# EAGLE design ArduinoDevBoardRevA (EAGLE 9.0.0)

## Sheet 1 of 2
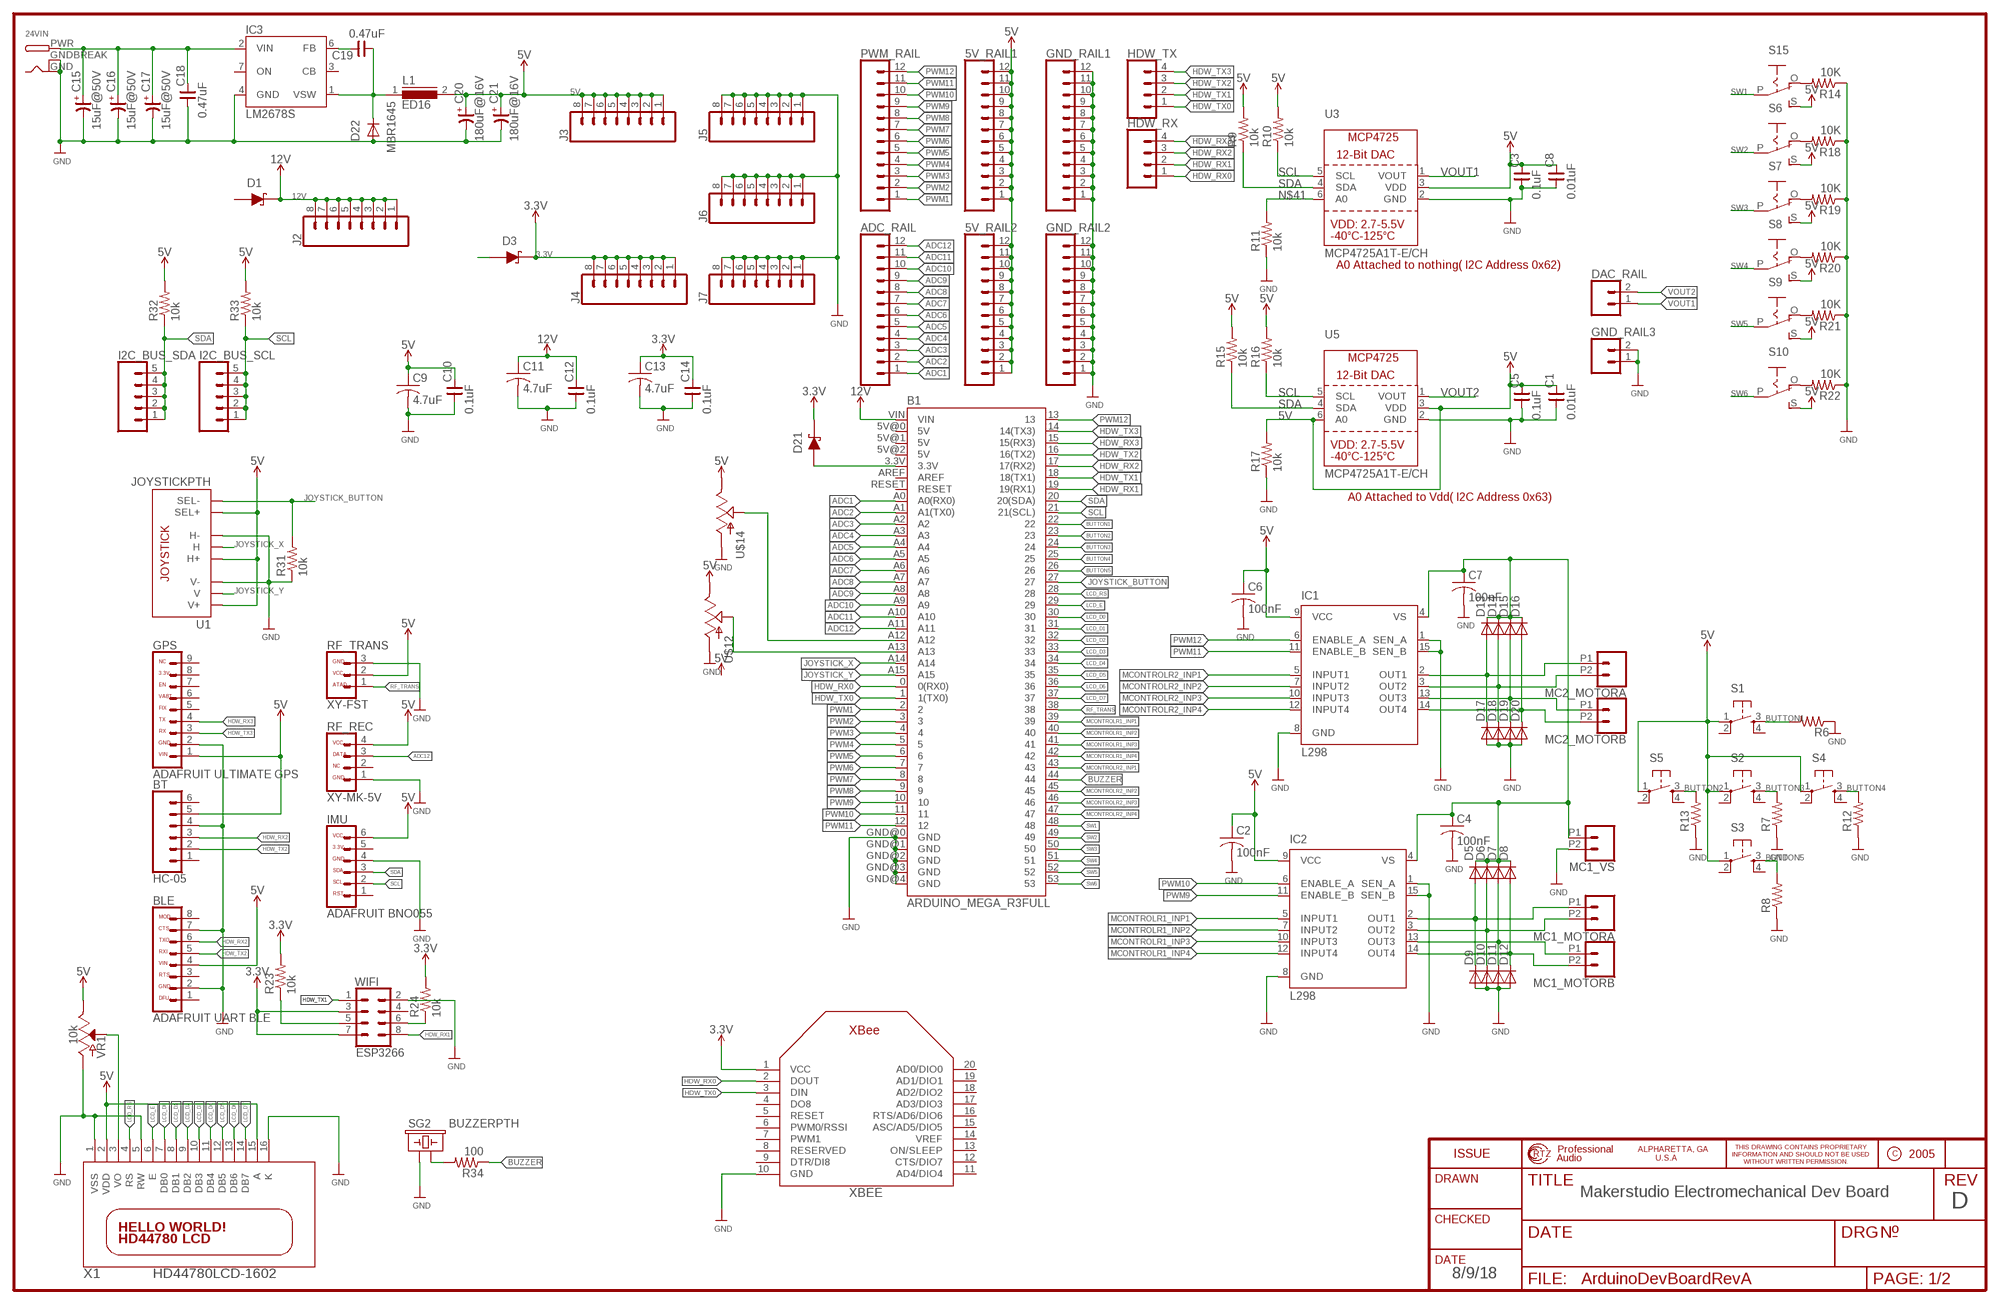
[diagram p0: schematic, sheet 1]

### Parts
5V_RAIL1  CONN_12  [1X12]
5V_RAIL2  CONN_12  [1X12]
24VIN  DCBARRELPTH  [DCJACK_2MM_PTH]
ADC_RAIL  CONN_12  [1X12]
B1  ARDUINO_MEGA_R3FULL  [ARDUINO_MEGA]
BLE  ADAFRUIT UART BLE  CONN_08"  [1X08]
BT  HC-05  CONN_06SILK_FEMALE_PTH  [1X06]
C1  0.01uF  CNP-0805  [0805]
C2  100nF  C-US050-024X044  [C050-024X044]
C3  0.1uF  CNP-0805  [0805]
C4  100nF  C-US050-024X044  [C050-024X044]
C5  0.1uF  CNP-0805  [0805]
C6  100nF  C-US050-024X044  [C050-024X044]
C7  100nF  C-US050-024X044  [C050-024X044]
C8  0.01uF  CNP-0805  [0805]
C9  4.7uF  C-US050-024X044  [C050-024X044]
C10  0.1uF  CNP-0805  [0805]
C11  4.7uF  C-USC0805  [C0805]
C12  0.1uF  CNP-0805  [0805]
C13  4.7uF  C-USC0805  [C0805]
C14  0.1uF  CNP-0805  [0805]
C15  15uF@50V  CP-E-025X065  [E-025X065]
C16  15uF@50V  CP-E-025X065  [E-025X065]
C17  15uF@50V  CP-E-025X065  [E-025X065]
C18  0.47uF  CNP-0805  [0805]
C19  0.47uF  CNP-0805  [0805]
C20  180uF@16V  CP-E-025X065  [E-025X065]
C21  180uF@16V  CP-E-025X065  [E-025X065]
D1  D_SCHOTTKYK  [SOD-123]
D3  D_SCHOTTKYK  [SOD-123]
D5  DIODE-D-5  [D-5]
D6  DIODE-D-5  [D-5]
D7  DIODE-D-5  [D-5]
D8  DIODE-D-5  [D-5]
D9  DIODE-D-5  [D-5]
D10  DIODE-D-5  [D-5]
D11  DIODE-D-5  [D-5]
D12  DIODE-D-5  [D-5]
D13  DIODE-D-5  [D-5]
D14  DIODE-D-5  [D-5]
D15  DIODE-D-5  [D-5]
D16  DIODE-D-5  [D-5]
D17  DIODE-D-5  [D-5]
D18  DIODE-D-5  [D-5]
D19  DIODE-D-5  [D-5]
D20  DIODE-D-5  [D-5]
D21  D_SCHOTTKYK  [SOD-123]
D22  MBR1645  MBR750  [TO220AC]
DAC_RAIL  CONN_02  [1X02]
GND_RAIL1  CONN_12  [1X12]
GND_RAIL2  CONN_12  [1X12]
GND_RAIL3  CONN_02  [1X02]
GPS  ADAFRUIT ULTIMATE GPS  CONN_09  [1X09]
HDW_RX  CONN_04  [1X04]
HDW_TX  CONN_04  [1X04]
I2C_BUS_SCL  CONN_05  [1X05]
I2C_BUS_SDA  CONN_05  [1X05]
IC1  L298  [MULTIWATT-15]
IC2  L298  [MULTIWATT-15]
IC3  LM2678S  [TO263-7]
IMU  ADAFRUIT BNO055  CONN_06SILK_FEMALE_PTH  [1X06]
J2  CONN_08"  [1X08]
J3  CONN_08"  [1X08]
J4  CONN_08"  [1X08]
J5  CONN_08"  [1X08]
J6  CONN_08"  [1X08]
J7  CONN_08"  [1X08]
L1  ED16  [ED16]
MC1_MOTORA  CONN_022.54MM_SCREWTERM  [1X02_2.54_SCREWTERM]
MC1_MOTORB  CONN_022.54MM_SCREWTERM  [1X02_2.54_SCREWTERM]
MC1_VS  CONN_022.54MM_SCREWTERM  [1X02_2.54_SCREWTERM]
MC2_MOTORA  CONN_022.54MM_SCREWTERM  [1X02_2.54_SCREWTERM]
MC2_MOTORB  CONN_022.54MM_SCREWTERM  [1X02_2.54_SCREWTERM]
PWM_RAIL  CONN_12  [1X12]
R6  R-US_R0805  [R0805]
R7  R-US_R0805  [R0805]
R8  R-US_R0805  [R0805]
R9  10k  R-US_R0805  [R0805]
R10  10k  R-US_R0805  [R0805]
R11  10k  R-US_R0805  [R0805]
R12  R-US_R0805  [R0805]
R13  R-US_R0805  [R0805]
R14  10K  R-US_R0805  [R0805]
R15  10k  R-US_R0805  [R0805]
R16  10k  R-US_R0805  [R0805]
R17  10k  R-US_R0805  [R0805]
R18  10K  R-US_R0805  [R0805]
R19  10K  R-US_R0805  [R0805]
R20  10K  R-US_R0805  [R0805]
R21  10K  R-US_R0805  [R0805]
R22  10K  R-US_R0805  [R0805]
R23  10k  R-US_R0805  [R0805]
R24  10k  R-US_R0805  [R0805]
R31  10k  R-US_R0805  [R0805]
R32  10k  R-US_R0805  [R0805]
R33  10k  R-US_R0805  [R0805]
R34  100  R-US_R0805  [R0805]
RF_REC  XY-MK-5V  CONN_04  [1X04]
RF_TRANS  XY-FST  CONN_03  [1X03]
S1  TAC_SWITCHSMD  [TACTILE_SWITCH_SMD]
S2  TAC_SWITCHSMD  [TACTILE_SWITCH_SMD]
S3  TAC_SWITCHSMD  [TACTILE_SWITCH_SMD]
S4  TAC_SWITCHSMD  [TACTILE_SWITCH_SMD]
S5  TAC_SWITCHSMD  [TACTILE_SWITCH_SMD]
S6  EG1218S  [EG1218]
S7  EG1218S  [EG1218]
S8  EG1218S  [EG1218]
S9  EG1218S  [EG1218]
S10  EG1218S  [EG1218]
S15  EG1218S  [EG1218]
SG2  BUZZERPTH  [BUZZER-12MM]
U1  JOYSTICKPTH  [JOYSTICK]
U3  MCP4725A1T-E/CH  DAC_MCP4725  [SOT23-6]
U5  MCP4725A1T-E/CH  DAC_MCP4725  [SOT23-6]
U$12  POT  [ALPS_POT]
U$14  POT  [ALPS_POT]
VR1  10k  POTENTIOMETER-PTH-9MM-1/20W-20%-KIT  [POT-PTH-ALPS-KIT]
WIFI  ESP3266  CONN_04X2  [2X4]
X1  HD44780LCD-1602  [LCD1602]
XBEE  XBEE  [XBEE]

### Nets
3.3V [3.3V]: C13.1 C14.2 D3.2(C) D21.2(C) J4.1 J4.2 J4.3 J4.4 J4.5 J4.6 J4.7 J4.8 R23.2 R24.2 WIFI.3 WIFI.7 XBEE.1(VCC)
5V [5V]: 5V_RAIL1.1 5V_RAIL1.2 5V_RAIL1.3 5V_RAIL1.4 5V_RAIL1.5 5V_RAIL1.6 5V_RAIL1.7 5V_RAIL1.8 5V_RAIL1.9 5V_RAIL1.10 5V_RAIL1.11 5V_RAIL1.12 5V_RAIL2.1 5V_RAIL2.2 5V_RAIL2.3 5V_RAIL2.4 5V_RAIL2.5 5V_RAIL2.6 5V_RAIL2.7 5V_RAIL2.8 5V_RAIL2.9 5V_RAIL2.10 5V_RAIL2.11 5V_RAIL2.12 BLE.4 BT.5 C1.2 C2.1 C3.2 C5.2 C6.1 C8.2 C9.1 C10.2 C20.+ C21.+ GPS.1 IC1.9(VCC) IC2.9(VCC) IMU.6 J3.1 J3.2 J3.3 J3.4 J3.5 J3.6 J3.7 J3.8 L1.2 R9.2 R10.2 R15.2 R16.2 R17.2 R32.2 R33.2 RF_REC.4 RF_TRANS.2 S1.1 S2.1 S3.1 S4.1 S5.1 S6.S S7.S S8.S S9.S S10.S S15.S U1.B1A(SEL+) U1.H1(H+) U1.V1(V+) U3.3(VDD) U5.3(VDD) U5.6(A0) U$12.P$1(E) U$14.P$1(E) VR1.P$1(E) X1.2(VDD) X1.15(A) ; also sheet 2
12V [12V]: B1.VIN C11.1 C12.2 D1.2(C) J2.1 J2.2 J2.3 J2.4 J2.5 J2.6 J2.7 J2.8
ADC1: ADC_RAIL.1 B1.A0(A0(RX0)) ; also sheet 2
ADC2: ADC_RAIL.2 B1.A1(A1(TX0)) ; also sheet 2
ADC3: ADC_RAIL.3 B1.A2 ; also sheet 2
ADC4: ADC_RAIL.4 B1.A3
ADC5: ADC_RAIL.5 B1.A4
ADC6: ADC_RAIL.6 B1.A5
ADC7: ADC_RAIL.7 B1.A6
ADC8: ADC_RAIL.8 B1.A7
ADC9: ADC_RAIL.9 B1.A8
ADC10: ADC_RAIL.10 B1.A9
ADC11: ADC_RAIL.11 B1.A10
ADC12: ADC_RAIL.12 B1.A11 RF_REC.3
BUTTON1: B1.22 R6.2 S1.3
BUTTON2: B1.23 R13.2 S5.3
BUTTON3: B1.24 R7.2 S2.3
BUTTON4: B1.25 R12.2 S4.3
BUTTON5: B1.26 R8.2 S3.3
BUZZER: B1.44 R34.1
GND: 24VIN.GND 24VIN.GNDBREAK B1.GND@0(GND) B1.GND@1(GND) B1.GND@2(GND) B1.GND@3(GND) B1.GND@4(GND) BLE.2 BLE.7 BT.4 C1.1 C2.2 C3.1 C4.2 C5.1 C6.2 C7.2 C8.1 C9.2 C10.1 C11.2 C12.1 C13.2 C14.1 C15.- C16.- C17.- C18.1 C20.- C21.- D9.A D10.A D11.A D12.A D17.A D18.A D19.A D20.A D22.A GND_RAIL1.1 GND_RAIL1.2 GND_RAIL1.3 GND_RAIL1.4 GND_RAIL1.5 GND_RAIL1.6 GND_RAIL1.7 GND_RAIL1.8 GND_RAIL1.9 GND_RAIL1.10 GND_RAIL1.11 GND_RAIL1.12 GND_RAIL2.1 GND_RAIL2.2 GND_RAIL2.3 GND_RAIL2.4 GND_RAIL2.5 GND_RAIL2.6 GND_RAIL2.7 GND_RAIL2.8 GND_RAIL2.9 GND_RAIL2.10 GND_RAIL2.11 GND_RAIL2.12 GND_RAIL3.1 GND_RAIL3.2 GPS.2 IC1.1(SEN_A) IC1.8(GND) IC1.15(SEN_B) IC2.1(SEN_A) IC2.8(GND) IC2.15(SEN_B) IC3.4(GND) IMU.4 J5.1 J5.2 J5.3 J5.4 J5.5 J5.6 J5.7 J5.8 J6.1 J6.2 J6.3 J6.4 J6.5 J6.6 J6.7 J6.8 J7.1 J7.2 J7.3 J7.4 J7.5 J7.6 J7.7 J7.8 MC1_VS.P2 R6.1 R7.1 R8.1 R11.1 R12.1 R13.1 R14.1 R17.1 R18.1 R19.1 R20.1 R21.1 R22.1 R31.1 RF_REC.1 RF_TRANS.3 SG2.+ U1.H3(H-) U1.V3(V-) U3.2(GND) U5.2(GND) U$12.P$3(A) U$14.P$3(A) VR1.P$3(A) WIFI.2 X1.1(VSS) X1.5(RW) X1.16(K) XBEE.10(GND) ; also sheet 2
HDW_RX0: B1.0(0(RX0)) HDW_RX.1 XBEE.2(DOUT)
HDW_RX1: B1.19(19(RX1)) HDW_RX.2 WIFI.8
HDW_RX2: B1.17(17(RX2)) BLE.6 BT.3 HDW_RX.3
HDW_RX3: B1.15(15(RX3)) GPS.4 HDW_RX.4
HDW_TX0: B1.1(1(TX0)) HDW_TX.1 XBEE.3(DIN)
HDW_TX1: B1.18(18(TX1)) HDW_TX.2 WIFI.1
HDW_TX2: B1.16(16(TX2)) BLE.5 BT.2 HDW_TX.3
HDW_TX3: B1.14(14(TX3)) GPS.3 HDW_TX.4
JOYSTICK_BUTTON: B1.27 R31.2 U1.B2A(SEL-)
JOYSTICK_X: B1.A14 U1.H2(H)
JOYSTICK_Y: B1.A15 U1.V2(V)
LCD_D0: B1.30 X1.7(DB0)
LCD_D1: B1.31 X1.8(DB1)
LCD_D2: B1.32 X1.9(DB2)
LCD_D3: B1.33 X1.10(DB3)
LCD_D4: B1.34 X1.11(DB4)
LCD_D5: B1.35 X1.12(DB5)
LCD_D6: B1.36 X1.13(DB6)
LCD_D7: B1.37 X1.14(DB7)
LCD_E: B1.29 X1.6(E)
LCD_RS: B1.28 X1.4(RS)
MCONTROLR1_INP1: B1.39 IC2.5(INPUT1)
MCONTROLR1_INP2: B1.40 IC2.7(INPUT2)
MCONTROLR1_INP3: B1.41 IC2.10(INPUT3)
MCONTROLR1_INP4: B1.42 IC2.12(INPUT4)
MCONTROLR2_INP1: B1.43 IC1.5(INPUT1)
MCONTROLR2_INP2: B1.45 IC1.7(INPUT2)
MCONTROLR2_INP3: B1.46 IC1.10(INPUT3)
MCONTROLR2_INP4: B1.47 IC1.12(INPUT4)
N$1 [3.3V]: B1.3.3V D21.1(A)
N$2: R23.1 WIFI.5
N$3: 24VIN.PWR C15.+ C16.+ C17.+ C18.2 IC3.2(VIN)
N$4: R24.1 WIFI.6
N$6: C19.1 D22.C IC3.1(VSW) L1.1
N$7: C19.2 IC3.6(FB)
N$11 [12V]: D3.1(A)
N$12 [12V]: C4.1 C7.1 D5.C D6.C D7.C D8.C D13.C D14.C D15.C D16.C IC1.4(VS) IC2.4(VS) MC1_VS.P1
N$33 [12V]: D13.A D17.C IC1.2(OUT1) MC2_MOTORA.P1
N$34 [12V]: D14.A D18.C IC1.3(OUT2) MC2_MOTORA.P2
N$35 [12V]: D15.A D19.C IC1.13(OUT3) MC2_MOTORB.P1
N$36 [12V]: D16.A D20.C IC1.14(OUT4) MC2_MOTORB.P2
N$37: B1.A12 U$14.P$2(S)
N$38: B1.A13 U$12.P$2(S)
N$39: VR1.P$2(S) X1.3(VO)
N$40: R34.2 SG2.-
N$41: R11.2 U3.6(A0)
N$46 [12V]: D5.A D9.C IC2.2(OUT1) MC1_MOTORA.P1
N$47 [12V]: D6.A D10.C IC2.3(OUT2) MC1_MOTORA.P2
N$48 [12V]: D7.A D11.C IC2.13(OUT3) MC1_MOTORB.P1
N$49 [12V]: D8.A D12.C IC2.14(OUT4) MC1_MOTORB.P2
N$50: R14.2 S15.O
N$52: R18.2 S6.O
N$53: R19.2 S7.O
N$54: R20.2 S8.O
N$55: R21.2 S9.O
N$56: R22.2 S10.O
PWM1: B1.2 PWM_RAIL.1
PWM2: B1.3 PWM_RAIL.2
PWM3: B1.4 PWM_RAIL.3
PWM4: B1.5 PWM_RAIL.4
PWM5: B1.6 PWM_RAIL.5
PWM6: B1.7 PWM_RAIL.6
PWM7: B1.8 PWM_RAIL.7
PWM8: B1.9 PWM_RAIL.8
PWM9: B1.10 IC2.11(ENABLE_B) PWM_RAIL.9
PWM10: B1.11 IC2.6(ENABLE_A) PWM_RAIL.10
PWM11: B1.12 IC1.11(ENABLE_B) PWM_RAIL.11
PWM12: B1.13 IC1.6(ENABLE_A) PWM_RAIL.12
RF_TRANS: B1.38 RF_TRANS.1
SCL: B1.21(21(SCL)) I2C_BUS_SCL.1 I2C_BUS_SCL.2 I2C_BUS_SCL.3 I2C_BUS_SCL.4 I2C_BUS_SCL.5 IMU.2 R10.1 R16.1 R33.1 U3.5(SCL) U5.5(SCL) ; also sheet 2
SDA: B1.20(20(SDA)) I2C_BUS_SDA.1 I2C_BUS_SDA.2 I2C_BUS_SDA.3 I2C_BUS_SDA.4 I2C_BUS_SDA.5 IMU.3 R9.1 R15.1 R32.1 U3.4(SDA) U5.4(SDA) ; also sheet 2
SW1: B1.48 S15.P
SW2: B1.49 S6.P
SW3: B1.50 S7.P
SW4: B1.51 S8.P
SW5: B1.52 S9.P
SW6: B1.53 S10.P
VOUT1: DAC_RAIL.1 U3.1(VOUT)
VOUT2: DAC_RAIL.2 U5.1(VOUT)
Unconnected: B1.5V@0(5V) B1.5V@1(5V) B1.5V@2(5V) B1.AREF B1.RESET BLE.1 BLE.3 BLE.8 BT.1 BT.6 D1.1(A) GPS.5 GPS.6 GPS.7 GPS.8 GPS.9 IC3.3(CB) IC3.7(ON) IMU.1 IMU.5 RF_REC.2 S1.2 S1.4 S2.2 S2.4 S3.2 S3.4 S4.2 S4.4 S5.2 S5.4 WIFI.4 XBEE.4(DO8) XBEE.5(RESET) XBEE.6(PWM0/RSSI) XBEE.7(PWM1) XBEE.8(RESERVED) XBEE.9(DTR/DI8) XBEE.11(AD4/DIO4) XBEE.12(CTS/DIO7) XBEE.13(ON/SLEEP) XBEE.14(VREF) XBEE.15(ASC/AD5/DIO5) XBEE.16(RTS/AD6/DIO6) XBEE.17(AD3/DIO3) XBEE.18(AD2/DIO2) XBEE.19(AD1/DIO1) XBEE.20(AD0/DIO0)

### Notes on the sheet
- A0 Attached to nothing( I2C Address 0x62)
- A0 Attached to Vdd( I2C Address 0x63)
- NC | GND
- 3.3V | VCC
- EN | ATAD
- VABT
- FIX
- TX
- RX
- GND | VCC
- VIN | DATA
- NC
- GND
- VCC
- 3.3V
- GND
- SDA
- SCL
- RST
- MOD
- CTS
- TXO
- RXI
- VIN
- RTS
- GND
- DFU
- Makerstudio Electromechanical Dev Board
- D
- 8/9/18

## Sheet 2 of 2
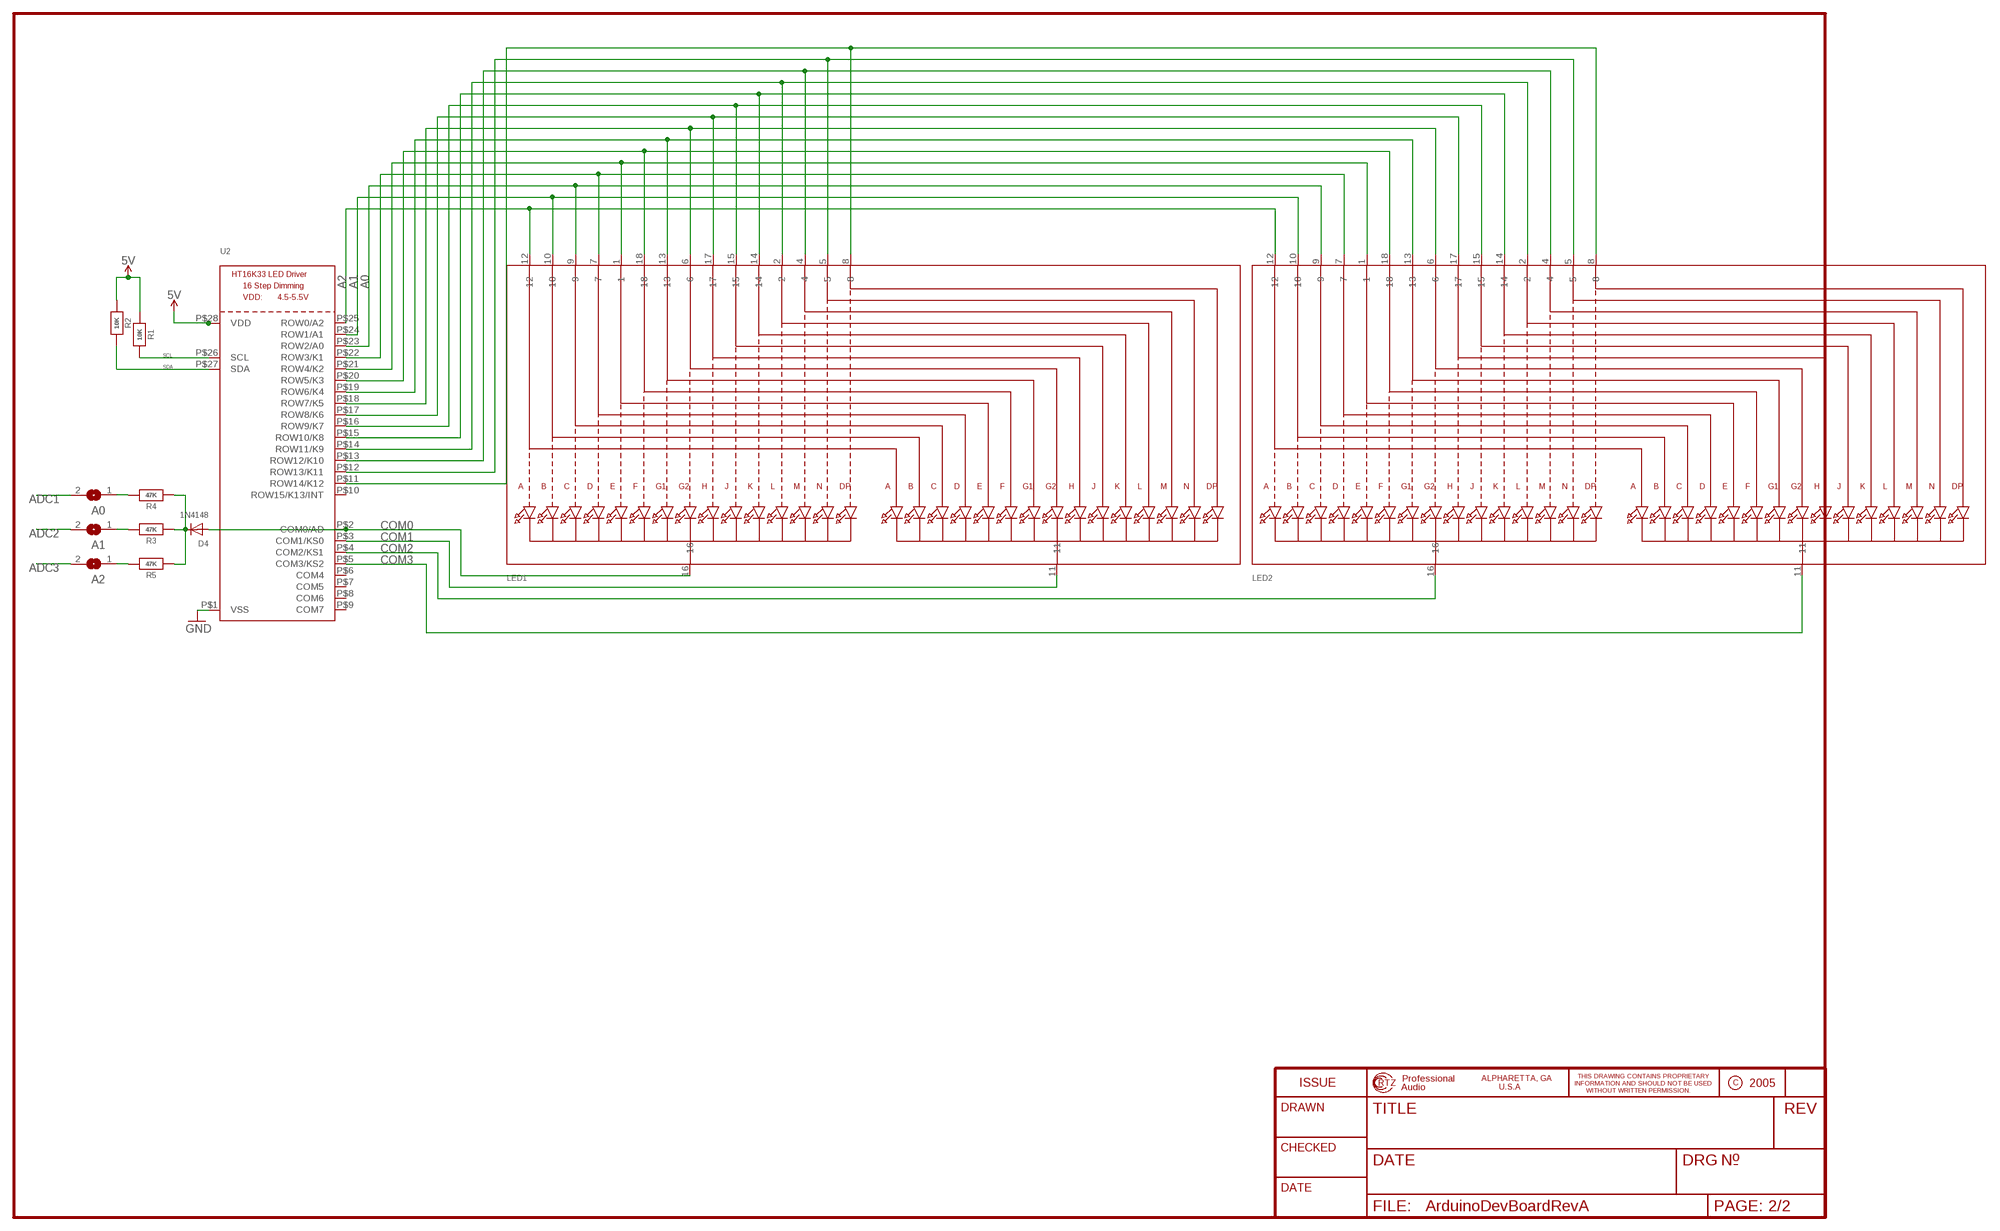
[diagram p1: schematic, sheet 2]

### Parts
A0  SOLDERJUMPERREFLOW_NOPASTE  [SOLDERJUMPER_REFLOW_NOPASTE]
A1  SOLDERJUMPERREFLOW_NOPASTE  [SOLDERJUMPER_REFLOW_NOPASTE]
A2  SOLDERJUMPERREFLOW_NOPASTE  [SOLDERJUMPER_REFLOW_NOPASTE]
D4  1N4148  DIODESOD-323F  [SOD-323F]
LED1  DISP_SEGMENT_STARBURST_DUAL_COMMONCATHODE  [SEGMENT_STARTBUST_DUAL_KWA-541CBB]
LED2  DISP_SEGMENT_STARBURST_DUAL_COMMONCATHODE  [SEGMENT_STARTBUST_DUAL_KWA-541CBB]
R1  10K  RESISTOR0805_NOOUTLINE  [0805-NO]
R2  10K  RESISTOR0805_NOOUTLINE  [0805-NO]
R3  47K  RESISTOR0805_NOOUTLINE  [0805-NO]
R4  47K  RESISTOR0805_NOOUTLINE  [0805-NO]
R5  47K  RESISTOR0805_NOOUTLINE  [0805-NO]
U2  HT16K33_SOP28  [SOP28_300MIL]

### Nets
5V [5V]: R1.1 R2.1 U2.P$28(VDD) ; also sheet 1
A0: LED1.9 LED2.9 U2.P$23(ROW2/A0)
A1: LED1.10 LED2.10 U2.P$24(ROW1/A1)
A2: LED1.12 LED2.12 U2.P$25(ROW0/A2)
ADC1: A0.2 ; also sheet 1
ADC2: A1.2 ; also sheet 1
ADC3: A2.2 ; also sheet 1
COM0: D4.A LED1.16 U2.P$2(COM0/AD)
COM1: LED1.11 U2.P$3(COM1/KS0)
COM2: LED2.16 U2.P$4(COM2/KS1)
COM3: LED2.11 U2.P$5(COM3/KS2)
GND: U2.P$1(VSS) ; also sheet 1
N$16: LED1.7 LED2.7 U2.P$22(ROW3/K1)
N$17: LED1.1 LED2.1 U2.P$21(ROW4/K2)
N$18: LED1.18 LED2.18 U2.P$20(ROW5/K3)
N$19: A1.1 R3.2
N$20: A0.1 R4.2
N$21: LED1.13 LED2.13 U2.P$19(ROW6/K4)
N$22: LED1.6 LED2.6 U2.P$18(ROW7/K5)
N$23: D4.C R3.1 R4.1 R5.1
N$24: A2.1 R5.2
N$25: LED1.17 LED2.17 U2.P$17(ROW8/K6)
N$26: LED1.15 LED2.15 U2.P$16(ROW9/K7)
N$27: LED1.14 LED2.14 U2.P$15(ROW10/K8)
N$28: LED1.2 LED2.2 U2.P$14(ROW11/K9)
N$29: LED1.4 LED2.4 U2.P$13(ROW12/K10)
N$30: LED1.5 LED2.5 U2.P$12(ROW13/K11)
N$31: LED1.8 LED2.8 U2.P$11(ROW14/K12)
SCL: R1.2 U2.P$26(SCL) ; also sheet 1
SDA: R2.2 U2.P$27(SDA) ; also sheet 1
Unconnected: U2.P$6(COM4) U2.P$7(COM5) U2.P$8(COM6) U2.P$9(COM7) U2.P$10(ROW15/K13/INT)

## Library data of the parts
5V_RAIL1 5V_RAIL2 ADC_RAIL GND_RAIL1 GND_RAIL2 PWM_RAIL = SparkFun-Connectors:CONN_12: Multi connection point. Often used as Generic Header-pin footprint for 0.1 inch spaced/style header connections On any of the 0.1 inch spaced packages, you can populate with these: Break Away Headers - Straight <https://www.sparkfun.com/products/116> (PRT-00116) Break Away Male Headers - Right Angle <https://www.sparkfun.com/products/553> (PRT-00553) Female Headers <https://www.sparkfun.com/products/115> (PRT-00115) Break Away Headers - Machine Pin <https://www.sparkfun.com/products/117> (PRT-00117) Break Away Female Headers - Swiss Machine Pin <https://www.sparkfun.com/products/743> (PRT-00743) For SCREWTERMINALS and SPRING TERMINALS visit here: Screw Terimnals on SparkFun.com <https://www.sparkfun.com/search/results?term=Screw+Terminals> (5mm/3.5mm/2.54mm spacing) This device is also useful as a general connection point to wire up your design to another part of your project. Our various solder wires solder well into these plated through hole pads. Hook-Up Wire - Assortment (Stranded, 22 AWG) <https://www.sparkfun.com/products/11375> (PRT-11375) Hook-Up Wire - Assortment (Solid Core, 22 AWG) <https://www.sparkfun.com/products/11367> (PRT-11367) View the entire wire category on our website here <https://www.sparkfun.com/categories/141> Special notes: Molex polarized connector foot print use with SKU : PRT-08231 with associated crimp pins and housings. 1MM SMD Version SKU: PRT-10208 NOTES ON THE VARIANTS LOCK and LOCK_LONGPADS... This footprint was designed to help hold the alignment of a through-hole component (i.e. 6-pin header) while soldering it into place. You may notice that each hole has been shifted either up or down by 0.005 of an inch from it's more standard position (which is a perfectly straight line). This slight alteration caused the pins (the squares in the middle) to touch the edges of the holes. Because they are alternating, it causes a "brace" to hold the component in place. 0.005 has proven to be the perfect amount of "off-center" position when using our standard breakaway headers. Although looks a little odd when you look at the bare footprint, once you have a header in there, the alteration is very hard to notice. Also,if you push a header all the way into place, it is covered up entirely on the bottom side.
24VIN = adafruit:DCBARREL: 2.0mm DC Barrel Jack DCJACK_2MM_PTH - Through Hole Jack (4UConnector: 05537)
A0 A1 A2 = microbuilder:SOLDERJUMPER: SMD Solder JUMPER Solder the two pads together to create a connection, or remove the solder to break it. REFLOW - Use this footprint for solder paste and reflow ovens. WAVE - Use this footprint for hand-soldering (larger pads). CLOSED - Has a trace between the two pads to ensure it is closed by default. The trace needs to be cut to disable the jumper, and can be closed again by creating a solder bridge between the two pads.
B1 = SparkFun-Boards:ARDUINO_MEGA_R3: Arduino Mega R3 ATmega2560 R3 compatible footprint. SparkFun Products: Arduino Mega 2560 R3 <https://www.sparkfun.com/products/11061>
BLE J2-J7 = SparkFun-Connectors:CONN_08: Multi connection point. Often used as Generic Header-pin footprint for 0.1 inch spaced/style header connections On any of the 0.1 inch spaced packages, you can populate with these: Break Away Headers - Straight <https://www.sparkfun.com/products/116> (PRT-00116) Break Away Male Headers - Right Angle <https://www.sparkfun.com/products/553> (PRT-00553) Female Headers <https://www.sparkfun.com/products/115> (PRT-00115) Break Away Headers - Machine Pin <https://www.sparkfun.com/products/117> (PRT-00117) Break Away Female Headers - Swiss Machine Pin <https://www.sparkfun.com/products/743> (PRT-00743) Arduino Stackable Header - 8 Pin <https://www.sparkfun.com/products/9279> (PRT-09279) For SCREWTERMINALS and SPRING TERMINALS visit here: Screw Terimnals on SparkFun.com <https://www.sparkfun.com/search/results?term=Screw+Terminals> (5mm/3.5mm/2.54mm spacing) This device is also useful as a general connection point to wire up your design to another part of your project. Our various solder wires solder well into these plated through hole pads. Hook-Up Wire - Assortment (Stranded, 22 AWG) <https://www.sparkfun.com/products/11375> (PRT-11375) Hook-Up Wire - Assortment (Solid Core, 22 AWG) <https://www.sparkfun.com/products/11367> (PRT-11367) View the entire wire category on our website here <https://www.sparkfun.com/categories/141> Special notes: Molex polarized connector foot print use with SKU : PRT-08231 with associated crimp pins and housings. 1MM SMD Version SKU: PRT-10208 NOTES ON THE VARIANTS LOCK and LOCK_LONGPADS... This footprint was designed to help hold the alignment of a through-hole component (i.e. 6-pin header) while soldering it into place. You may notice that each hole has been shifted either up or down by 0.005 of an inch from it's more standard position (which is a perfectly straight line). This slight alteration caused the pins (the squares in the middle) to touch the edges of the holes. Because they are alternating, it causes a "brace" to hold the component in place. 0.005 has proven to be the perfect amount of "off-center" position when using our standard breakaway headers. Although looks a little odd when you look at the bare footprint, once you have a header in there, the alteration is very hard to notice. Also,if you push a header all the way into place, it is covered up entirely on the bottom side.; PROD_ID: CONN-08438
BT IMU = SparkFun-Connectors:CONN_06: Multi connection point. Often used as Generic Header-pin footprint for 0.1 inch spaced/style header connections On any of the 0.1 inch spaced packages, you can populate with these: Break Away Headers - Straight <https://www.sparkfun.com/products/116> (PRT-00116) Break Away Male Headers - Right Angle <https://www.sparkfun.com/products/553> (PRT-00553) Female Headers <https://www.sparkfun.com/products/115> (PRT-00115) Break Away Headers - Machine Pin <https://www.sparkfun.com/products/117> (PRT-00117) Break Away Female Headers - Swiss Machine Pin <https://www.sparkfun.com/products/743> (PRT-00743) Arduino Stackable Header - 6 Pin <https://www.sparkfun.com/products/9280> (PRT-09280) For SCREWTERMINALS and SPRING TERMINALS visit here: Screw Terimnals on SparkFun.com <https://www.sparkfun.com/search/results?term=Screw+Terminals> (5mm/3.5mm/2.54mm spacing) This device is also useful as a general connection point to wire up your design to another part of your project. Our various solder wires solder well into these plated through hole pads. Hook-Up Wire - Assortment (Stranded, 22 AWG) <https://www.sparkfun.com/products/11375> (PRT-11375) Hook-Up Wire - Assortment (Solid Core, 22 AWG) <https://www.sparkfun.com/products/11367> (PRT-11367) View the entire wire category on our website here <https://www.sparkfun.com/categories/141>; PROD_ID: CONN-08437
C1 C3 C5 C8 C10 C12 C14 C18 C19 = cap-master:CNP-: NON-POLARIZED CAP
C2 C4 C6 C7 C9 C11 C13 = rcl:C-US: CAPACITOR, American symbol; SPICEPREFIX: C
C15-C17 C20 C21 = cap-master:CP-: POLARIZED CAP
D1 D3 D21 = MAX9812:D_SCHOTTKY: Schottky diodes in various packages
D4 = adafruit:DIODE: Diode SMADIODE - SMA Surface Mount Package 20V 1A Schottky Diode Digikey: 641-1014-6-ND DO-1N4148 - Through Hole Small Current Diode SOD-123 20V 1 A (.5mV Vf) Schottky Diode - Digikey: MBRX120TPMSCT-ND SOD-323 10V 570mA (.38mV Vf, 3ns) Schottky Diode - Digikey: ZLLS410CT-ND SOD-523 30V 30mA Schottky Diode (RB751S-40TE61) - Digikey: RB751S-40TE61CT-ND SOT23-R/W - SOT23 Package (R = Solder Paste/Reflow Ovens, W = Hand-Soldering) BAT54Film 40V 300mA - Digikey: 497-7162-1-ND
D5-D20 = diode:DIODE-: DIODE
D22 = diode:MBR750: DIODE barrier rectifier, 7.5 A, 50 V
DAC_RAIL GND_RAIL3 MC1_MOTORA MC1_MOTORB MC1_VS MC2_MOTORA MC2_MOTORB = SparkFun-Connectors:CONN_02: Multi connection point. Often used as Generic Header-pin footprint for 0.1 inch spaced/style header connections On any of the 0.1 inch spaced packages, you can populate with these: Break Away Headers - Straight <https://www.sparkfun.com/products/116> (PRT-00116) Break Away Male Headers - Right Angle <https://www.sparkfun.com/products/553> (PRT-00553) Female Headers <https://www.sparkfun.com/products/115> (PRT-00115) Break Away Headers - Machine Pin <https://www.sparkfun.com/products/117> (PRT-00117) Break Away Female Headers - Swiss Machine Pin <https://www.sparkfun.com/products/743> (PRT-00743) For SCREWTERMINALS and SPRING TERMINALS visit here: Screw Terimnals on SparkFun.com <https://www.sparkfun.com/search/results?term=Screw+Terminals> (5mm/3.5mm/2.54mm spacing) This device is also useful as a general connection point to wire up your design to another part of your project. Our various solder wires solder well into these plated through hole pads. Hook-Up Wire - Assortment (Stranded, 22 AWG) <https://www.sparkfun.com/products/11375> (PRT-11375) Hook-Up Wire - Assortment (Solid Core, 22 AWG) <https://www.sparkfun.com/products/11367> (PRT-11367) View the entire wire category on our website here <https://www.sparkfun.com/categories/141> Special notes: Molex polarized connector foot print use with: PRT-08233 with associated crimp pins and housings. 2.54_SCREWTERM for use with PRT-10571. 3.5mm Screw Terminal footprints for PRT-08084 5mm Screw Terminal footprints for use with PRT-08432
GPS = SparkFun-Connectors:CONN_09: Multi connection point. Often used as Generic Header-pin footprint for 0.1 inch spaced/style header connections On any of the 0.1 inch spaced packages, you can populate with these: Break Away Headers - Straight <https://www.sparkfun.com/products/116> (PRT-00116) Break Away Male Headers - Right Angle <https://www.sparkfun.com/products/553> (PRT-00553) Female Headers <https://www.sparkfun.com/products/115> (PRT-00115) Break Away Headers - Machine Pin <https://www.sparkfun.com/products/117> (PRT-00117) Break Away Female Headers - Swiss Machine Pin <https://www.sparkfun.com/products/743> (PRT-00743) For SCREWTERMINALS and SPRING TERMINALS visit here: Screw Terimnals on SparkFun.com <https://www.sparkfun.com/search/results?term=Screw+Terminals> (5mm/3.5mm/2.54mm spacing) This device is also useful as a general connection point to wire up your design to another part of your project. Our various solder wires solder well into these plated through hole pads. Hook-Up Wire - Assortment (Stranded, 22 AWG) <https://www.sparkfun.com/products/11375> (PRT-11375) Hook-Up Wire - Assortment (Solid Core, 22 AWG) <https://www.sparkfun.com/products/11367> (PRT-11367) View the entire wire category on our website here <https://www.sparkfun.com/categories/141> Special notes: Molex polarized connector foot print use with SKU : PRT-08231 with associated crimp pins and housings. 1MM SMD Version SKU: PRT-10208 NOTES ON THE VARIANTS LOCK and LOCK_LONGPADS... This footprint was designed to help hold the alignment of a through-hole component (i.e. 6-pin header) while soldering it into place. You may notice that each hole has been shifted either up or down by 0.005 of an inch from it's more standard position (which is a perfectly straight line). This slight alteration caused the pins (the squares in the middle) to touch the edges of the holes. Because they are alternating, it causes a "brace" to hold the component in place. 0.005 has proven to be the perfect amount of "off-center" position when using our standard breakaway headers. Although looks a little odd when you look at the bare footprint, once you have a header in there, the alteration is very hard to notice. Also,if you push a header all the way into place, it is covered up entirely on the bottom side.
HDW_RX HDW_TX RF_REC = SparkFun-Connectors:CONN_04: Multi connection point. Often used as Generic Header-pin footprint for 0.1 inch spaced/style header connections On any of the 0.1 inch spaced packages, you can populate with these: Break Away Headers - Straight <https://www.sparkfun.com/products/116> (PRT-00116) Break Away Male Headers - Right Angle <https://www.sparkfun.com/products/553> (PRT-00553) Female Headers <https://www.sparkfun.com/products/115> (PRT-00115) Break Away Headers - Machine Pin <https://www.sparkfun.com/products/117> (PRT-00117) Break Away Female Headers - Swiss Machine Pin <https://www.sparkfun.com/products/743> (PRT-00743) For SCREWTERMINALS and SPRING TERMINALS visit here: Screw Terimnals on SparkFun.com <https://www.sparkfun.com/search/results?term=Screw+Terminals> (5mm/3.5mm/2.54mm spacing) This device is also useful as a general connection point to wire up your design to another part of your project. Our various solder wires solder well into these plated through hole pads. Hook-Up Wire - Assortment (Stranded, 22 AWG) <https://www.sparkfun.com/products/11375> (PRT-11375) Hook-Up Wire - Assortment (Solid Core, 22 AWG) <https://www.sparkfun.com/products/11367> (PRT-11367) View the entire wire category on our website here <https://www.sparkfun.com/categories/141> Special notes: Molex polarized connector foot print use with SKU : PRT-08231 with associated crimp pins and housings. 1MM SMD Version SKU: PRT-10208; PROD_ID: CONN-09696
I2C_BUS_SCL I2C_BUS_SDA = SparkFun-Connectors:CONN_05: Multi connection point. Often used as Generic Header-pin footprint for 0.1 inch spaced/style header connections On any of the 0.1 inch spaced packages, you can populate with these: Break Away Headers - Straight <https://www.sparkfun.com/products/116> (PRT-00116) Break Away Male Headers - Right Angle <https://www.sparkfun.com/products/553> (PRT-00553) Female Headers <https://www.sparkfun.com/products/115> (PRT-00115) Break Away Headers - Machine Pin <https://www.sparkfun.com/products/117> (PRT-00117) Break Away Female Headers - Swiss Machine Pin <https://www.sparkfun.com/products/743> (PRT-00743) For SCREWTERMINALS and SPRING TERMINALS visit here: Screw Terimnals on SparkFun.com <https://www.sparkfun.com/search/results?term=Screw+Terminals> (5mm/3.5mm/2.54mm spacing) This device is also useful as a general connection point to wire up your design to another part of your project. Our various solder wires solder well into these plated through hole pads. Hook-Up Wire - Assortment (Stranded, 22 AWG) <https://www.sparkfun.com/products/11375> (PRT-11375) Hook-Up Wire - Assortment (Solid Core, 22 AWG) <https://www.sparkfun.com/products/11367> (PRT-11367) View the entire wire category on our website here <https://www.sparkfun.com/categories/141> Special notes: Molex polarized connector foot print use with SKU : PRT-08231 with associated crimp pins and housings. 1MM SMD Version SKU: PRT-10208
IC1 IC2 = st-microelectronics:L298: DUAL FULL-BRIDGE DRIVER; MPN: L298N; OC_FARNELL: 1589425; OC_NEWARK: 32M1527
IC3 = v-reg-3:LM2678: National Semiconductor <http://www.national.com> 5.0A "Simple Switcher"(c) 260kHz, Vout 1.2-37V, Vin 40V, 120mOhm DMOS switch, 50µA standby current
L1 = inductors:ED16: INDUCTOR; SPICEPREFIX: L
LED1 LED2 = microbuilder:DISP_SEGMENT_STARBURST_DUAL_COMMONCATHODE: 2 x Starburst Segment Displays - Common Cathode Luckylight KWA-541CBB
R1-R5 = microbuilder:RESISTOR: Resistors For new designs, use the packages preceded by an '_' character since they are more reliable: The following footprints should be used on most boards: _0402 - Standard footprint for regular board layouts _0603 - Standard footprint for regular board layouts _0805 - Standard footprint for regular board layouts _1206 - Standard footprint for regular board layouts For extremely tight-pitch boards where space is at a premium, the following 'micro-pitch' footprints can be used (smaller pads, no silkscreen outline, etc.): _0402MP - Micro-pitch footprint for very dense/compact boards _0603MP - Micro-pitch footprint for very dense/compact boards _0805MP - Micro-pitch footprint for very dense/compact boards _1206MP - Micro-pitch footprint for very dense/compact boards
R6-R24 R31-R34 = adafruit:R-US_: RESISTOR, American symbol
RF_TRANS = SparkFun-Connectors:CONN_03: Multi connection point. Often used as Generic Header-pin footprint for 0.1 inch spaced/style header connections On any of the 0.1 inch spaced packages, you can populate with these: Break Away Headers - Straight <https://www.sparkfun.com/products/116> (PRT-00116) Break Away Male Headers - Right Angle <https://www.sparkfun.com/products/553> (PRT-00553) Female Headers <https://www.sparkfun.com/products/115> (PRT-00115) Break Away Headers - Machine Pin <https://www.sparkfun.com/products/117> (PRT-00117) Break Away Female Headers - Swiss Machine Pin <https://www.sparkfun.com/products/743> (PRT-00743) Stackable Header - 3 Pin (Female, 0.1") <https://www.sparkfun.com/products/13875> (PRT-13875) For SCREWTERMINALS and SPRING TERMINALS visit here: Screw Terimnals on SparkFun.com <https://www.sparkfun.com/search/results?term=Screw+Terminals> (5mm/3.5mm/2.54mm spacing) This device is also useful as a general connection point to wire up your design to another part of your project. Our various solder wires solder well into these plated through hole pads. Hook-Up Wire - Assortment (Stranded, 22 AWG) <https://www.sparkfun.com/products/11375> (PRT-11375) Hook-Up Wire - Assortment (Solid Core, 22 AWG) <https://www.sparkfun.com/products/11367> (PRT-11367) View the entire wire category on our website here <https://www.sparkfun.com/categories/141> Special notes: Molex polarized connector foot print use with SKU : PRT-08232 with associated crimp pins and housings.
S1-S5 = SparkFun:TAC_SWITCH: Momentary Switch Button commonly used for reset or general input. Spark Fun Electronics SKU : COM-00097
S6-S10 S15 = adafruit:EG1218: SLIDING SWITCH 0.1" spacing through hole, vertical SPDT slide switch http://www.ladyada.net/library/pcb/eaglelibrary.html
SG2 = SparkFun:BUZZER: Buzzer 12mm Spark Fun Electronics SKU : Comp-Buzzer
U1 = adafruit:JOYSTICK: Thumb Joystick Joystick commonly found in PS2 controllers. Two pots and a select switch. Adapted from Sparkfun Library (but for more common 6mm switch sticks)
U2 = microbuilder:HT16K33_SOP28
U3 U5 = microbuilder:DAC_MCP4725: MCP4725 - 12-Bit I2C DAC with on-board EEPROM Settling Time: 6 µs 2.7-5.5V Supply 100kHz, 400kHz, 3.4 Mbps I²C EEPROM can be used to store a specific output voltage which will be set coming out of reset I²C Address: 1100 A2 A1 A0 A0 is set via the A0 pin, A2 and A1 are hard-wired on the chip depending on the model chosen: Part Number A2 A1 Code MCP4725A0T-E/CH 0 0 AJNN MCP4725A1T-E/CH 0 1 APNN MCP4725A2T-E/CH 1 0 AQNN MCP4725A3T-E/CH 1 1 ARNN
U$12 U$14 = SparkFun:POT
VR1 = SparkFun-Resistors:POTENTIOMETER: Potentiometer (Pot) Three-terminal potentiometers, with an adjustable wiper and two adjustable resistors. A pot can be used to create a configurable voltage divider, or as a variable resistor. Variants ALPS_POT and ALPS_POT_KIT - PTH, breadboard compatible, 9mm square pots Rotary Potentiometer - Linear (10k ohm) <https://www.sparkfun.com/products/9288> (COM-09288) The KIT variant exposes copper on only one side of the PTH pad, so the part can only be assembled on one side of the PCB. Useful for beginner soldering kits.; PROD_ID: RES-09177; SF_SKU: COM-09288
WIFI = SparkFun-Connectors:CONN_04X2: Multi connection point. Often used as Generic Header-pin footprint for 0.1 inch spaced/style header connections On any of the 0.1 inch spaced packages, you can populate with these: Break Away Headers - Straight <https://www.sparkfun.com/products/116> (PRT-00116) Break Away Male Headers - Right Angle <https://www.sparkfun.com/products/553> (PRT-00553) Female Headers <https://www.sparkfun.com/products/115> (PRT-00115) Break Away Headers - Machine Pin <https://www.sparkfun.com/products/117> (PRT-00117) Break Away Female Headers - Swiss Machine Pin <https://www.sparkfun.com/products/743> (PRT-00743)
X1 = adafruit:HD44780LCD: HD44780 LCD Standard character type LCDs, available in sizes from 8x1 to 40x4!
XBEE = adafruit:XBEE

## Net classes
0 default: width 0.203 mm, drill 0.254 mm, clearance 0.203 mm
1 5V: width 0.61 mm, drill 0.254 mm, clearance 0.203 mm
2 3.3V: width 0.61 mm, drill 0.254 mm, clearance 0.203 mm
3 12V: width 0.61 mm, drill 0.254 mm, clearance 0.203 mm
4 VIN: width 0.813 mm, drill 0.254 mm, clearance 0.203 mm

## Board
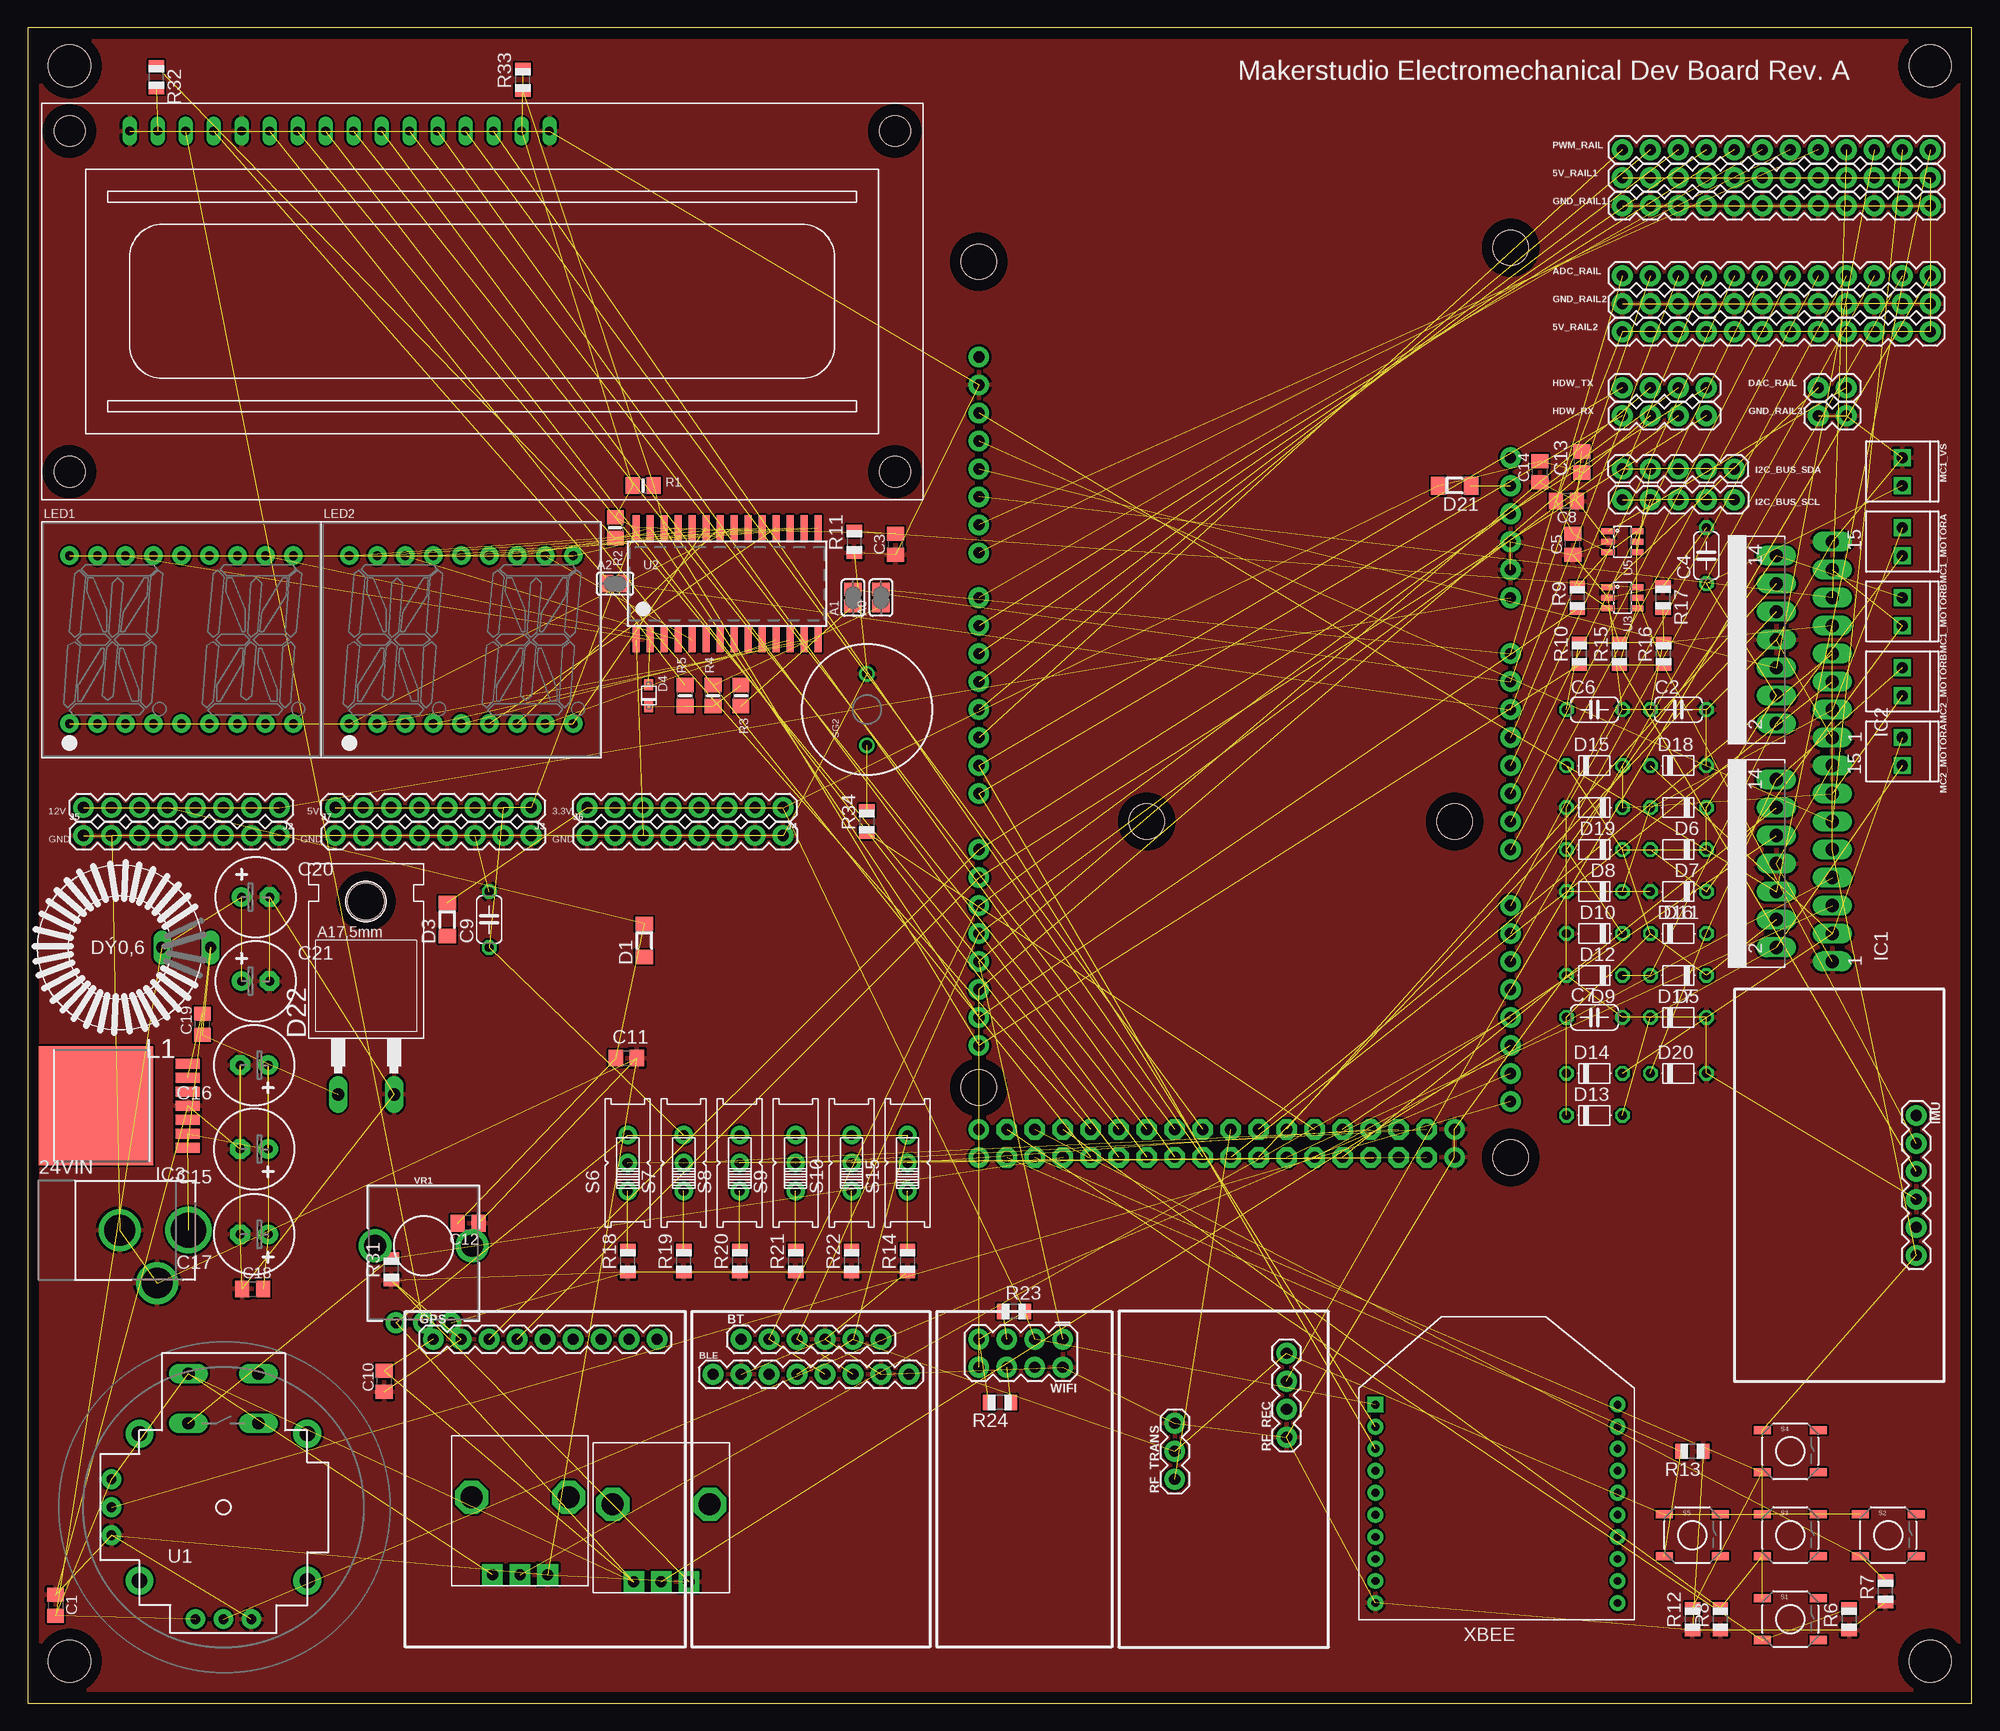
[diagram p2: board, top side]
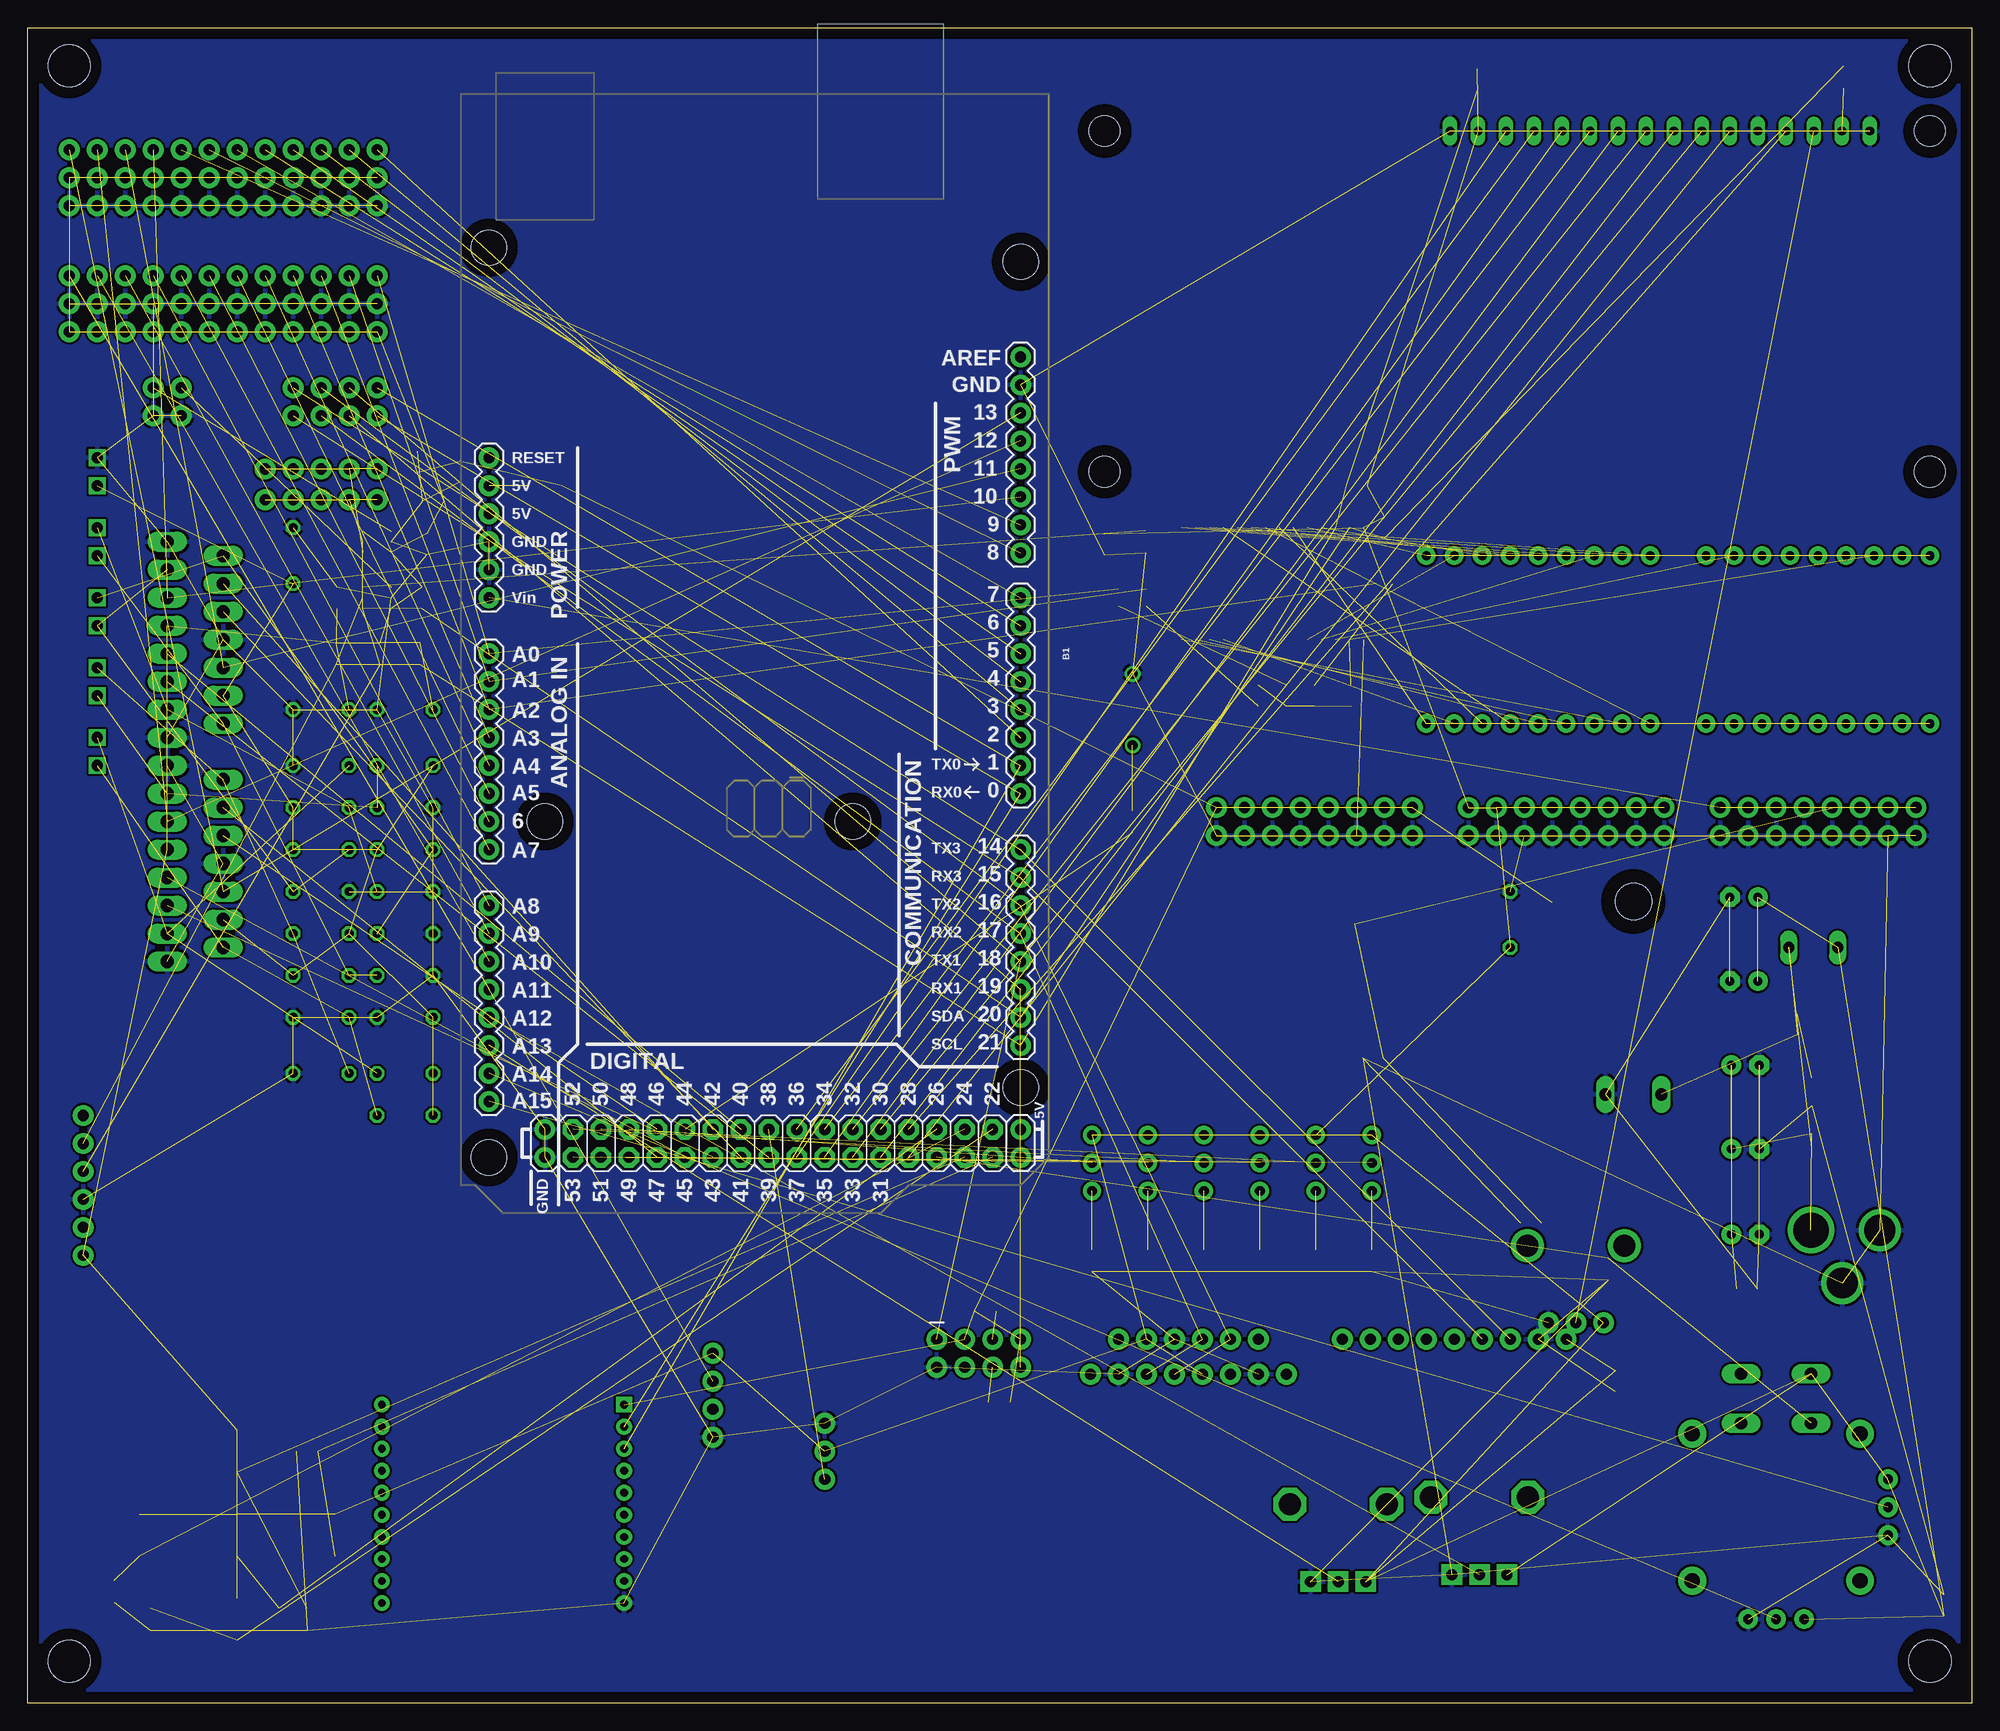
[diagram p3: board, bottom side, seen from below]

Size 176.51 x 152.07 mm. Coordinates in mm from the lower left corner, seen from the top.
Outline: 0,0 176.51,0 176.51,152.07 0,152.07 0,0
Copper layers (1*16): Top 0.035mm / dielectric 1.5mm / Bottom 0.035mm
Design rules "default *": minimum track width 6mil, minimum drill 0.2mm, track to track 8mil, track to pad 8mil, pad to pad 8mil, via to via 8mil, smd to smd 8mil, copper to edge 40mil, drill to drill 6mil, minimum pad ring 10mil, minimum via ring 8mil, stop-mask expansion 4mil, vias tented up to drill 0mil, thermal gap 10mil
Holes 3.81 mm at 3.81,148.59 172.72,148.59 172.72,3.81 3.81,3.81

### Footprints (pad centres in the part's own frame; a part is rotated, then mirrored left to right if it is on the bottom)
1X12 = drill 1.016 pad 1.88: 1 0,0; 2 2.54,0; 3 5.08,0; 4 7.62,0; 5 10.16,0; 6 12.7,0; 7 15.24,0; 8 17.78,0; 9 20.32,0; 10 22.86,0; 11 25.4,0; 12 27.94,0
DCJACK_2MM_PTH = drill 2.8: GND 0,7.35; GNDBREAK 4.8,10.75 | drill 3.2: PWR 0,13.6
SOLDERJUMPER_REFLOW_NOPASTE = smd 1.168 x 1.6: 1 -0.762,0; 2 0.762,0
ARDUINO_MEGA = drill 1.016 pad 1.88: 0 13.97,24.13; 1 11.43,24.13; 2 8.89,24.13; 3 6.35,24.13; 3.3V -13.97,-24.13; 4 3.81,24.13; 5 1.27,24.13; 5V@0 -11.43,-24.13; 5V@1 44.45,24.13; 5V@2 46.99,24.13; 6 -1.27,24.13; 7 -3.81,24.13; 8 -7.874,24.13; 9 -10.414,24.13; 10 -12.954,24.13; 11 -15.494,24.13; 12 -18.034,24.13; 13 -20.574,24.13; 14 19.05,24.13; 15 21.59,24.13; 16 24.13,24.13; 17 26.67,24.13; 18 29.21,24.13; 19 31.75,24.13; 20 34.29,24.13; 21 36.83,24.13; A0 1.27,-24.13; A1 3.81,-24.13; A2 6.35,-24.13; A3 8.89,-24.13; A4 11.43,-24.13; A5 13.97,-24.13; A6 16.51,-24.13; A7 19.05,-24.13; A8 24.13,-24.13; A9 26.67,-24.13; A10 29.21,-24.13; A11 31.75,-24.13; A12 34.29,-24.13; A13 36.83,-24.13; A14 39.37,-24.13; A15 41.91,-24.13; AREF -25.654,24.13; GND@0 -8.89,-24.13; GND@1 -6.35,-24.13; GND@2 44.45,-19.05; GND@3 46.99,-19.05; GND@4 -23.114,24.13; RESET -16.51,-24.13; VIN -3.81,-24.13 | drill 1.016 pad 1.88 octagon: 22 44.45,21.59; 23 46.99,21.59; 24 44.45,19.05; 25 46.99,19.05; 26 44.45,16.51; 27 46.99,16.51; 28 44.45,13.97; 29 46.99,13.97; 30 44.45,11.43; 31 46.99,11.43; 32 44.45,8.89; 33 46.99,8.89; 34 44.45,6.35; 35 46.99,6.35; 36 44.45,3.81; 37 46.99,3.81; 38 44.45,1.27; 39 46.99,1.27; 40 44.45,-1.27; 41 46.99,-1.27; 42 44.45,-3.81; 43 46.99,-3.81; 44 44.45,-6.35; 45 46.99,-6.35; 46 44.45,-8.89; 47 46.99,-8.89; 48 44.45,-11.43; 49 46.99,-11.43; 50 44.45,-13.97; 51 46.99,-13.97; 52 44.45,-16.51; 53 46.99,-16.51 | hole 3.2: -34.29,24.13; -35.56,-24.13; 16.51,8.89; 16.51,-19.05; 40.64,24.13; 46.99,-24.13
1X08 = drill 1.016 pad 1.88: 1 0,0; 2 2.54,0; 3 5.08,0; 4 7.62,0; 5 10.16,0; 6 12.7,0; 7 15.24,0; 8 17.78,0
1X06 = drill 1.016 pad 1.88: 1 0,0; 2 2.54,0; 3 5.08,0; 4 7.62,0; 5 10.16,0; 6 12.7,0
0805 = smd 1.27 x 1.524: 1 -0.953,0; 2 0.953,0
C050-024X044 = drill 0.813 octagon: 1 -2.54,0; 2 2.54,0
C0805 = smd 1.3 x 1.5: 1 -0.95,0; 2 0.95,0
E-025X065 = drill 0.813 pad 1.778: + -1.27,0 | drill 0.813 pad 1.778 octagon: - 1.27,0
SOD-123 = smd 1.3 x 1.6: 1 -1.5,0; 2 1.5,0
SOD-323F = smd 1 x 0.8: A -1,0; C 1,0
D-5 = drill 0.813 octagon: A 2.54,0; C -2.54,0
TO220AC = drill 1.118 long: A 2.54,-6.35; C -2.54,-6.35 | hole 3.302: 0,11.176
1X02 = drill 1.016 pad 1.88: 1 0,0; 2 2.54,0
1X09 = drill 1.016 pad 1.88: 1 0,0; 2 2.54,0; 3 5.08,0; 4 7.62,0; 5 10.16,0; 6 12.7,0; 7 15.24,0; 8 17.78,0; 9 20.32,0
1X04 = drill 1.016 pad 1.88: 1 0,0; 2 2.54,0; 3 5.08,0; 4 7.62,0
1X05 = drill 1.016 pad 1.88: 1 0,0; 2 2.54,0; 3 5.08,0; 4 7.62,0; 5 10.16,0
MULTIWATT-15 = drill 1.2 long: 1 -8.89,-7.62; 2 -7.62,-2.54; 3 -6.35,-7.62; 4 -5.08,-2.54; 5 -3.81,-7.62; 6 -2.54,-2.54; 7 -1.27,-7.62; 8 0,-2.54; 9 1.27,-7.62; 10 2.54,-2.54; 11 3.81,-7.62; 12 5.08,-2.54; 13 6.35,-7.62; 14 7.62,-2.54; 15 8.89,-7.62
TO263-7 = smd 0.91 x 2.16: 1 -3.81,-5.78; 2 -2.54,-5.78; 3 -1.27,-5.78; 4 0,-5.78; 5 1.27,-5.78; 6 2.54,-5.78; 7 3.81,-5.78 | smd 10.8 x 10.41: 8 0,2.54
ED16 = drill 1.016 long: 1 -8.255,0; 2 -3.81,0
SEGMENT_STARTBUST_DUAL_KWA-541CBB = drill 0.8 pad 1.676: 1 -10.16,-7.62; 2 -7.62,-7.62; 3 -5.08,-7.62; 4 -2.54,-7.62; 5 0,-7.62; 6 2.54,-7.62; 7 5.08,-7.62; 8 7.62,-7.62; 9 10.16,-7.62; 10 10.16,7.62; 11 7.62,7.62; 12 5.08,7.62; 13 2.54,7.62; 14 0,7.62; 15 -2.54,7.62; 16 -5.08,7.62; 17 -7.62,7.62; 18 -10.16,7.62
1X02_2.54_SCREWTERM = drill 1.016 square: P1 2.54,0; P2 0,0
0805-NO = smd 1.3 x 1.5: 1 -0.95,0; 2 0.95,0
R0805 = smd 1.1 x 1.4: 1 -1,0; 2 1,0
1X03 = drill 1.016 pad 1.88: 1 0,0; 2 2.54,0; 3 5.08,0
TACTILE_SWITCH_SMD = smd 1.524 x 0.762: 1 -2.54,1.905; 2 2.54,1.905; 3 -2.54,-1.905; 4 2.54,-1.905
EG1218 = drill 0.9 pad 1.676: O -2.54,0; P 0,0; S 2.54,0
BUZZER-12MM = drill 0.9: + 3.25,0; - -3.25,0
JOYSTICK = drill 1.1 pad 1.778 long: B1A -3.175,12.12; B1B 3.175,12.12; B2A -3.175,7.62; B2B 3.175,7.62 | drill 0.889 pad 1.778: H1 -2.54,-10.16; H2 0,-10.16; H3 2.54,-10.16; V1 -10.16,2.54; V2 -10.16,0; V3 -10.16,-2.54 | drill 1.397 pad 2.54: MOUNT1 -7.62,6.668; MOUNT2 -7.62,-6.668; MOUNT3 7.62,-6.668; MOUNT4 7.62,6.668
SOP28_300MIL = smd 0.635 x 2.286: P$1 -8.255,-5.08; P$2 -6.985,-5.08; P$3 -5.715,-5.08; P$4 -4.445,-5.08; P$5 -3.175,-5.08; P$6 -1.905,-5.08; P$7 -0.635,-5.08; P$8 0.635,-5.08; P$9 1.905,-5.08; P$10 3.175,-5.08; P$11 4.445,-5.08; P$12 5.715,-5.08; P$13 6.985,-5.08; P$14 8.255,-5.08; P$15 8.255,5.08; P$16 6.985,5.08; P$17 5.715,5.08; P$18 4.445,5.08; P$19 3.175,5.08; P$20 1.905,5.08; P$21 0.635,5.08; P$22 -0.635,5.08; P$23 -1.905,5.08; P$24 -3.175,5.08; P$25 -4.445,5.08; P$26 -5.715,5.08; P$27 -6.985,5.08; P$28 -8.255,5.08
SOT23-6 = smd 0.55 x 1.2: 1 -0.95,-1.3; 2 0,-1.3; 3 0.95,-1.3; 4 0.95,1.3; 5 0,1.3; 6 -0.95,1.3
ALPS_POT = drill 1 pad 1.88 square: P$1 7,-2.5; P$2 7,0; P$3 7,2.5 | drill 2 octagon: P$4 0,-4.4; P$5 0,4.4
POT-PTH-ALPS-KIT = drill 1 pad 1.88: P$1 7,-2.5; P$2 7,0; P$3 7,2.5 | drill 2: P$4 0,-4.4; P$5 0,4.4
2X4 = drill 1.016 pad 1.88: 1 -3.81,-1.27; 2 -3.81,1.27; 3 -1.27,-1.27; 4 -1.27,1.27; 5 1.27,-1.27; 6 1.27,1.27; 7 3.81,-1.27; 8 3.81,1.27
LCD1602 = drill 0.8 long: 1 8,33.46; 2 10.54,33.46; 3 13.08,33.46; 4 15.62,33.46; 5 18.16,33.46; 6 20.7,33.46; 7 23.24,33.46; 8 25.78,33.46; 9 28.32,33.46; 10 30.86,33.46; 11 33.4,33.46; 12 35.94,33.46; 13 38.48,33.46; 14 41.02,33.46; 15 43.56,33.46; 16 46.1,33.46 | hole 2.8: 2.54,2.54; 2.54,33.46; 77.46,33.46; 77.46,2.54
XBEE = drill 0.7 pad 1.422 square: 1 -11,5.5 | drill 0.7 pad 1.422: 2 -11,3.5; 3 -11,1.5; 4 -11,-0.5; 5 -11,-2.5; 6 -11,-4.5; 7 -11,-6.5; 8 -11,-8.5; 9 -11,-10.5; 10 -11,-12.5; 11 11,-12.5; 12 11,-10.5; 13 11,-8.5; 14 11,-6.5; 15 11,-4.5; 16 11,-2.5; 17 11,-0.5; 18 11,1.5; 19 11,3.5; 20 11,5.5

### Placement (x,y rotation side)
5V_RAIL1  144.78,138.43 0 top
5V_RAIL2  144.78,124.46 0 top
24VIN  1.02,42.93 270 top
A0  77.47,100.33 90 top
A1  74.93,100.33 90 top
A2  53.34,101.6 0 top
ADC_RAIL  144.78,129.54 0 top
B1  110.49,96.52 270 bottom
BLE  62.23,29.84 0 top
BT  64.77,33.02 0 top
C1  2.54,8.89 270 top
C2  149.86,90.17 0 top
C3  78.8,105.18 90 top
C4  152.4,104.14 90 top
C5  140.27,105.18 90 top
C6  142.24,90.17 0 top
C7  142.24,62.23 0 top
C8  139.7,109.09 180 top
C9  41.91,71.12 90 top
C10  32.38,29.21 90 top
C11  54.36,58.55 0 top
C12  40.01,43.56 180 top
C13  141.1,112.65 90 top
C14  137.29,111.76 90 top
C15  20.57,50.29 180 top
C16  20.57,57.91 180 top
C17  20.57,42.55 180 top
C18  20.45,37.59 0 top
C19  15.88,61.59 90 top
C20  20.7,73.15 0 top
C21  20.7,65.53 0 top
D1  56.01,69.22 90 top
D3  38.1,71.12 90 top
D4  56.39,91.44 270 top
D5  149.86,66.04 180 top
D6  149.86,81.28 180 top
D7  149.86,77.47 180 top
D8  142.24,77.47 180 top
D9  142.24,66.04 180 top
D10  142.24,73.66 180 top
D11  149.86,73.66 180 top
D12  142.24,69.85 180 top
D13  142.24,53.34 0 top
D14  142.24,57.15 0 top
D15  142.24,85.09 0 top
D16  149.86,69.85 0 top
D17  149.86,62.23 0 top
D18  149.86,85.09 0 top
D19  142.24,81.28 180 top
D20  149.86,57.15 0 top
D21  129.54,110.49 180 top
D22  30.73,61.59 0 top
DAC_RAIL  162.56,119.38 0 top
GND_RAIL1  144.78,135.89 0 top
GND_RAIL2  144.78,127 0 top
GND_RAIL3  162.56,116.84 0 top
GPS  36.83,33.02 0 top
HDW_RX  144.78,116.84 0 top
HDW_TX  144.78,119.38 0 top
I2C_BUS_SCL  144.78,109.22 0 top
I2C_BUS_SDA  154.94,112.01 180 top
IC1  156.21,76.2 90 top
IC2  156.21,96.52 90 top
IC3  8.76,54.23 90 top
IMU  171.45,53.34 270 top
J2  22.86,81.28 180 top
J3  45.72,81.28 180 top
J4  68.58,81.28 180 top
J5  5.08,78.74 0 top
J6  50.8,78.74 0 top
J7  27.94,78.74 0 top
L1  8.38,68.58 180 top
LED1  13.97,96.52 0 top
LED2  39.37,96.52 0 top
MC1_MOTORA  170.18,106.68 270 top
MC1_MOTORB  170.18,100.33 270 top
MC1_VS  170.18,113.03 270 top
MC2_MOTORA  170.18,87.63 270 top
MC2_MOTORB  170.18,93.98 270 top
PWM_RAIL  144.78,140.97 0 top
R1  55.88,110.49 0 top
R2  53.34,106.68 270 top
R3  64.77,91.44 270 top
R4  62.23,91.44 90 top
R5  59.69,91.44 90 top
R6  165.35,7.62 90 top
R7  168.66,10.16 90 top
R8  153.67,7.62 90 top
R9  140.69,100.32 90 top
R10  140.87,95.25 90 top
R11  75.05,105.4 90 top
R12  151.13,7.62 90 top
R13  151.13,22.86 180 top
R14  79.88,40.13 90 top
R15  144.5,95.24 90 top
R16  148.51,95.24 90 top
R17  148.47,100.34 270 top
R18  54.48,40.13 90 top
R19  59.56,40.13 90 top
R20  64.64,40.13 90 top
R21  69.72,40.13 90 top
R22  74.8,40.13 90 top
R23  89.53,35.56 0 top
R24  88.27,27.3 180 top
R31  33.02,39.37 90 top
R32  11.68,147.57 270 top
R33  44.96,147.32 90 top
R34  76.2,80.01 90 top
RF_REC  114.3,24.13 90 top
RF_TRANS  104.14,20.32 90 top
S1  160.02,7.62 0 top
S2  168.91,15.24 0 top
S3  160.02,15.24 0 top
S4  160.02,22.86 0 top
S5  151.13,15.24 0 top
S6  54.48,49.02 90 top
S7  59.56,49.02 90 top
S8  64.64,49.02 90 top
S9  69.72,49.02 90 top
S10  74.8,49.02 90 top
S15  79.88,49.02 90 top
SG2  76.2,90.17 90 top
U1  17.78,17.78 0 top
U2  63.5,101.6 0 top
U3  144.78,100.33 270 top
U5  144.78,105.41 270 top
U$12  57.53,18.03 270 top
U$14  44.7,18.67 270 top
VR1  35.94,41.53 270 top
WIFI  90.17,31.75 180 top
X1  1.27,109.22 0 top
XBEE  133.35,21.59 0 top

### Tracks (layer width: path | path; a pad name or v marks a point on that pad's centre or on a via)
3.3V  (16 unrouted)
5V  (82 unrouted)
12V  (11 unrouted)
A0  (2 unrouted)
A1  (2 unrouted)
A2  (2 unrouted)
ADC1  (2 unrouted)
ADC2  (2 unrouted)
ADC3  (2 unrouted)
ADC4  (1 unrouted)
ADC5  (1 unrouted)
ADC6  (1 unrouted)
ADC7  (1 unrouted)
ADC8  (1 unrouted)
ADC9  (1 unrouted)
ADC10  (1 unrouted)
ADC11  (1 unrouted)
ADC12  (2 unrouted)
BUTTON1  (2 unrouted)
BUTTON2  (2 unrouted)
BUTTON3  (2 unrouted)
BUTTON4  (2 unrouted)
BUTTON5  (2 unrouted)
BUZZER  (1 unrouted)
COM0  (2 unrouted)
COM1  (1 unrouted)
COM2  (1 unrouted)
COM3  (1 unrouted)
GND  (128 unrouted)
  pour Top: 0,0 0,152.4 176.53,152.4 176.53,0
  pour Bottom: 0,0 0,151.76 176.53,151.76 176.53,0
HDW_RX0  (2 unrouted)
HDW_RX1  (2 unrouted)
HDW_RX2  (3 unrouted)
HDW_RX3  (2 unrouted)
HDW_TX0  (2 unrouted)
HDW_TX1  (2 unrouted)
HDW_TX2  (3 unrouted)
HDW_TX3  (2 unrouted)
JOYSTICK_BUTTON  (2 unrouted)
JOYSTICK_X  (1 unrouted)
JOYSTICK_Y  (1 unrouted)
LCD_D0  (1 unrouted)
LCD_D1  (1 unrouted)
LCD_D2  (1 unrouted)
LCD_D3  (1 unrouted)
LCD_D4  (1 unrouted)
LCD_D5  (1 unrouted)
LCD_D6  (1 unrouted)
LCD_D7  (1 unrouted)
LCD_E  (1 unrouted)
LCD_RS  (1 unrouted)
MCONTROLR1_INP1  (1 unrouted)
MCONTROLR1_INP2  (1 unrouted)
MCONTROLR1_INP3  (1 unrouted)
MCONTROLR1_INP4  (1 unrouted)
MCONTROLR2_INP1  (1 unrouted)
MCONTROLR2_INP2  (1 unrouted)
MCONTROLR2_INP3  (1 unrouted)
MCONTROLR2_INP4  (1 unrouted)
N$1  (1 unrouted)
N$2  (1 unrouted)
N$3  (5 unrouted)
N$4  (1 unrouted)
N$6  (3 unrouted)
N$7  (1 unrouted)
N$12  (12 unrouted)
N$16  (2 unrouted)
N$17  (2 unrouted)
N$18  (2 unrouted)
N$19  (1 unrouted)
N$20  (1 unrouted)
N$21  (2 unrouted)
N$22  (2 unrouted)
N$23  (3 unrouted)
N$24  (1 unrouted)
N$25  (2 unrouted)
N$26  (2 unrouted)
N$27  (2 unrouted)
N$28  (2 unrouted)
N$29  (2 unrouted)
N$30  (2 unrouted)
N$31  (2 unrouted)
N$33  (3 unrouted)
N$34  (3 unrouted)
N$35  (3 unrouted)
N$36  (3 unrouted)
N$37  (1 unrouted)
N$38  (1 unrouted)
N$39  (1 unrouted)
N$40  (1 unrouted)
N$41  (1 unrouted)
N$46  (3 unrouted)
N$47  (3 unrouted)
N$48  (3 unrouted)
N$49  (3 unrouted)
N$50  (1 unrouted)
N$52  (1 unrouted)
N$53  (1 unrouted)
N$54  (1 unrouted)
N$55  (1 unrouted)
N$56  (1 unrouted)
PWM1  (1 unrouted)
PWM2  (1 unrouted)
PWM3  (1 unrouted)
PWM4  (1 unrouted)
PWM5  (1 unrouted)
PWM6  (1 unrouted)
PWM7  (1 unrouted)
PWM8  (1 unrouted)
PWM9  (2 unrouted)
PWM10  (2 unrouted)
PWM11  (2 unrouted)
PWM12  (2 unrouted)
RF_TRANS  (1 unrouted)
SCL  (13 unrouted)
SDA  (13 unrouted)
SW1  (1 unrouted)
SW2  (1 unrouted)
SW3  (1 unrouted)
SW4  (1 unrouted)
SW5  (1 unrouted)
SW6  (1 unrouted)
VOUT1  (1 unrouted)
VOUT2  (1 unrouted)

### Text on the board
tPlace: Makerstudio Electromechanical Dev Board Rev. A | 12V | 5V | 3.3V | GND | GND | GND